# Altium schematic sheet CURRENT_SOURCE.SchDoc
size 420 x 297 mm; SheetNumber: 5; SheetTotal: 6
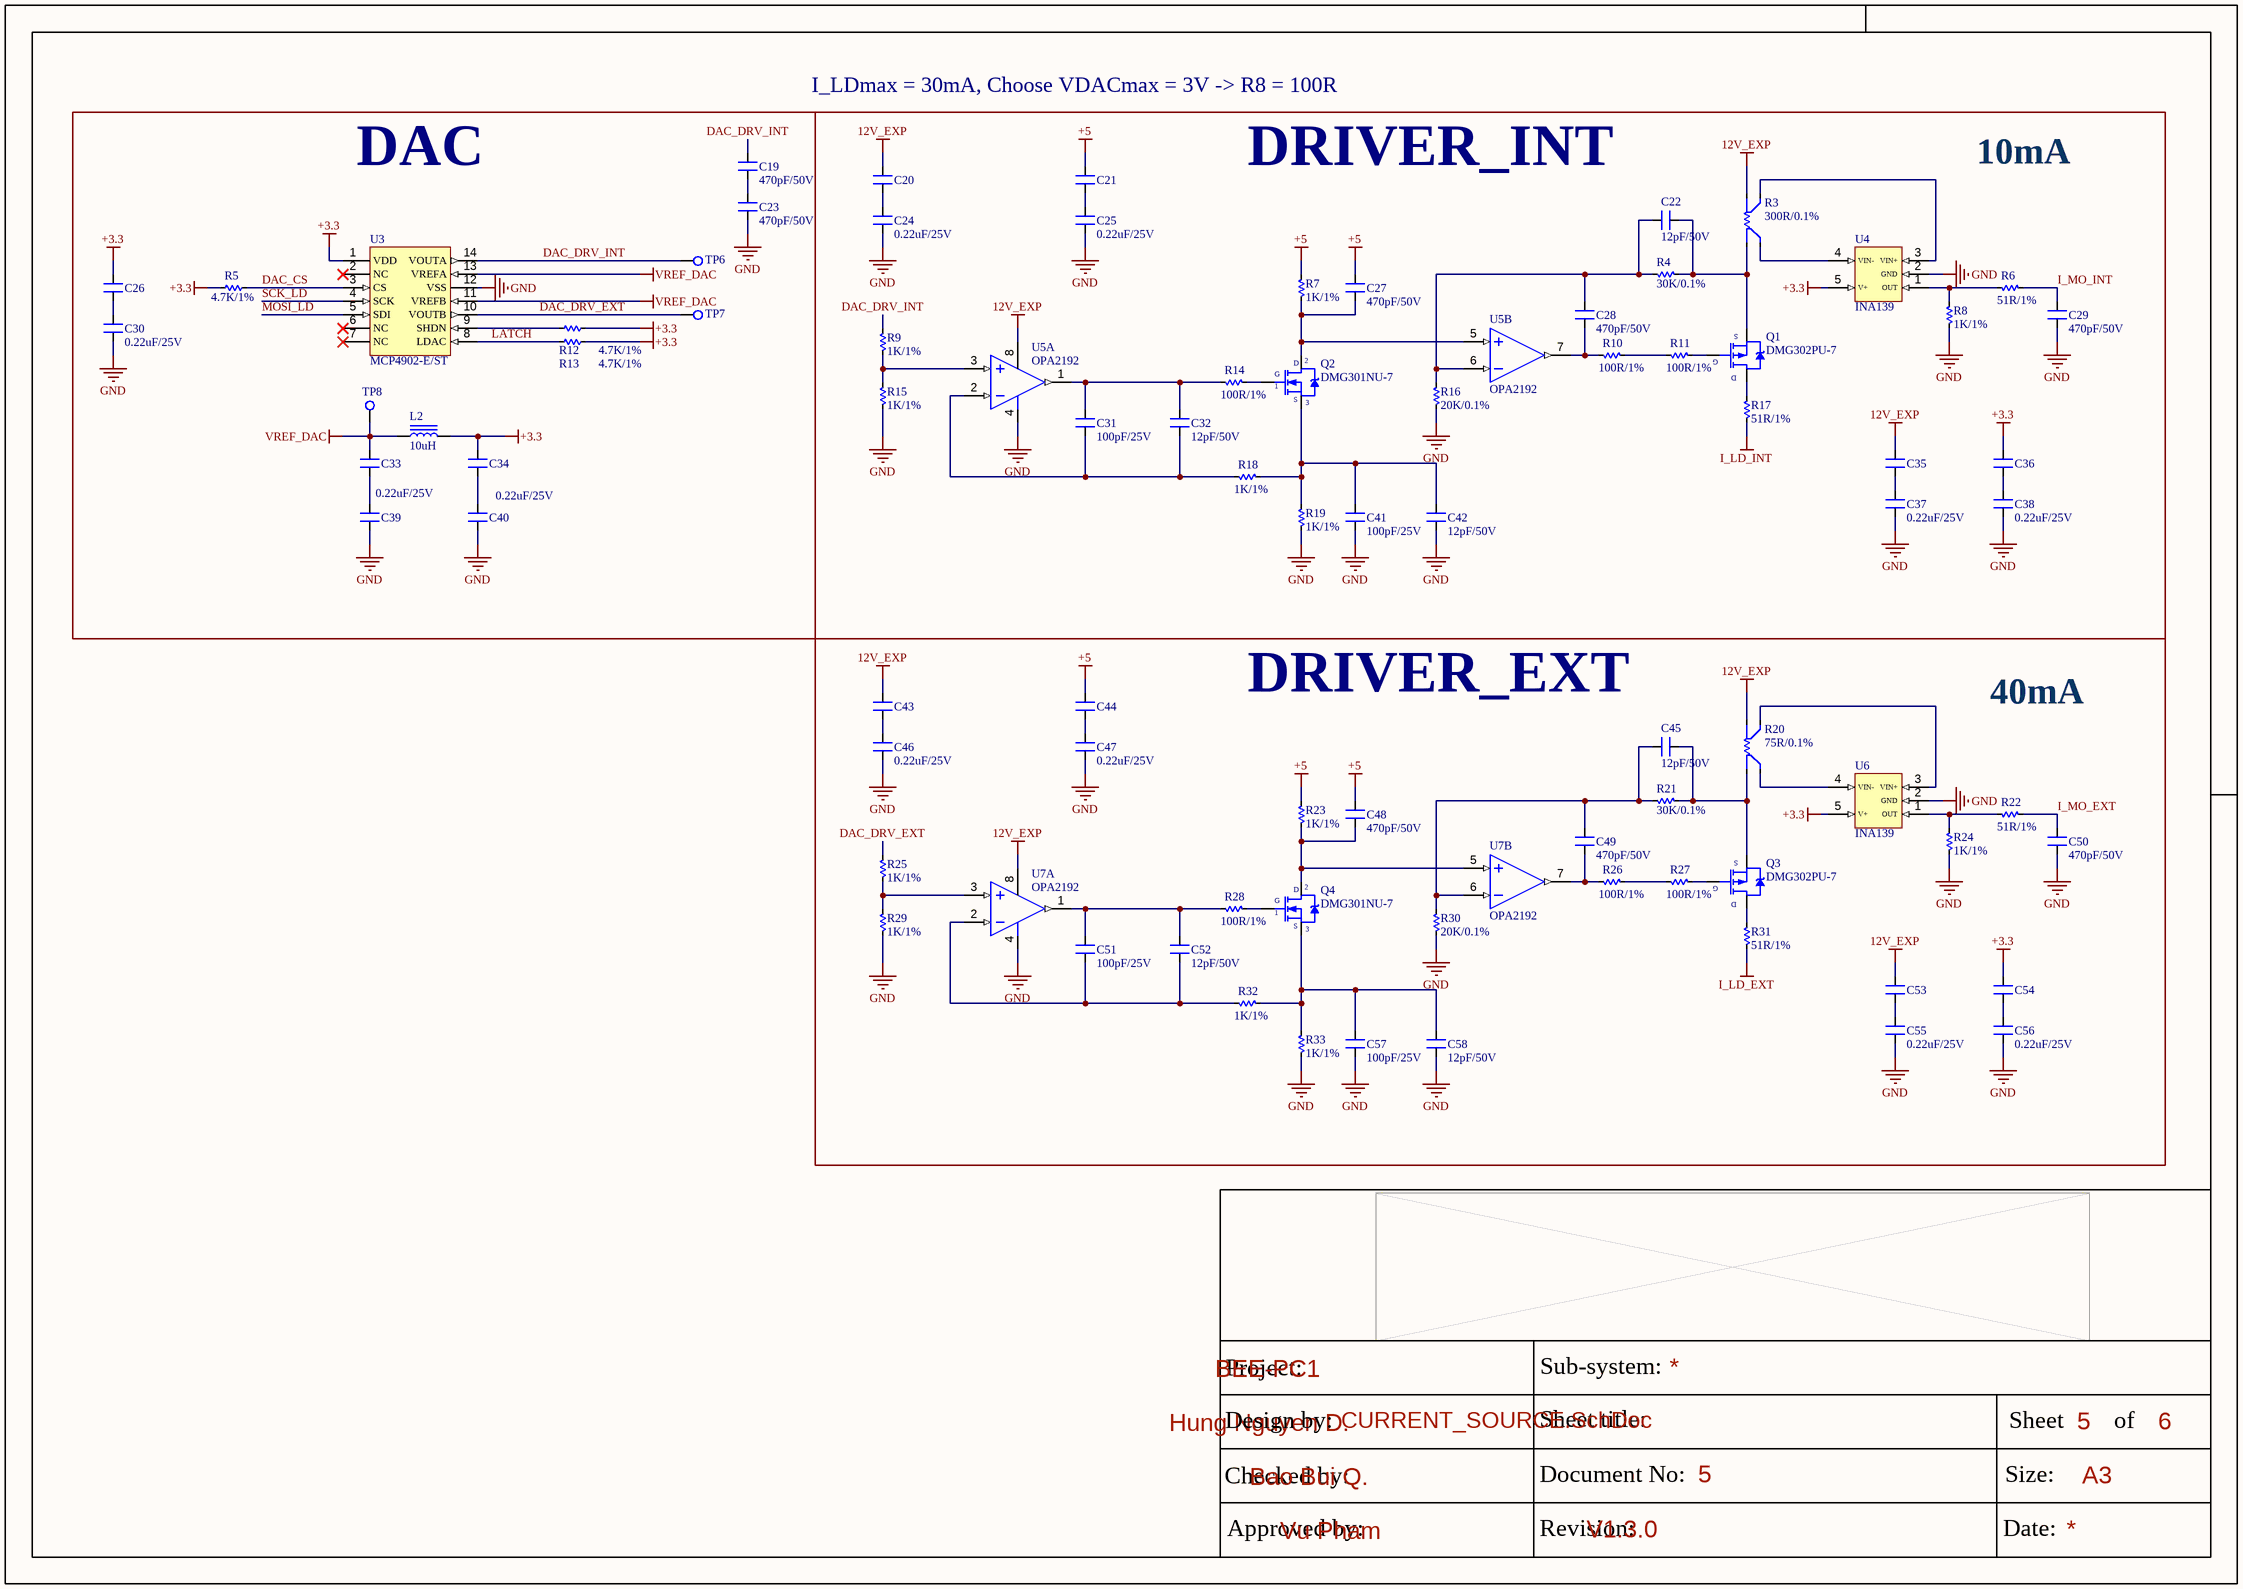
[diagram p0: CURRENT_SOURCE.SchDoc]

## Parts
C19  470pF/50V  [SM-0603]
C20  0.22uF/25V  [SM-0603]  (value not drawn)
C21  0.22uF/25V  [SM-0603]  (value not drawn)
C22  12pF/50V  [SM-0603]
C23  470pF/50V  [SM-0603]
C24  0.22uF/25V  [SM-0603]
C25  0.22uF/25V  [SM-0603]
C26  0.22uF/25V  [SM-0603]  (value not drawn)
C27  470pF/50V  [SM-0603]
C28  470pF/50V  [SM-0603]
C29  470pF/50V  [SM-0603]
C30  0.22uF/25V  [SM-0603]
C31  100pF/25V  [SM-0603]
C32  12pF/50V  [SM-0603]
C33  0.22uF/25V  [SM-0603]  (value not drawn)
C34  0.22uF/25V  [SM-0603]  (value not drawn)
C35  0.22uF/25V  [SM-0603]  (value not drawn)
C36  0.22uF/25V  [SM-0603]  (value not drawn)
C37  0.22uF/25V  [SM-0603]
C38  0.22uF/25V  [SM-0603]
C39  0.22uF/25V  [SM-0603]
C40  0.22uF/25V  [SM-0603]
C41  100pF/25V  [SM-0603]
C42  12pF/50V  [SM-0603]
C43  0.22uF/25V  [SM-0603]  (value not drawn)
C44  0.22uF/25V  [SM-0603]  (value not drawn)
C45  12pF/50V  [SM-0603]
C46  0.22uF/25V  [SM-0603]
C47  0.22uF/25V  [SM-0603]
C48  470pF/50V  [SM-0603]
C49  470pF/50V  [SM-0603]
C50  470pF/50V  [SM-0603]
C51  100pF/25V  [SM-0603]
C52  12pF/50V  [SM-0603]
C53  0.22uF/25V  [SM-0603]  (value not drawn)
C54  0.22uF/25V  [SM-0603]  (value not drawn)
C55  0.22uF/25V  [SM-0603]
C56  0.22uF/25V  [SM-0603]
C57  100pF/25V  [SM-0603]
C58  12pF/50V  [SM-0603]
L2  10uH  [FER 0805/2012]
Q1  DMG302PU-7  [SOT23-3-132]
Q2  DMG301NU-7  [SOT23-3-132]
Q3  DMG302PU-7  [SOT23-3-132]
Q4  DMG301NU-7  [SOT23-3-132]
R3  300R/0.1%  [RES_SMD_0603_SHUNT]
R4  30K/0.1%  [RES-SMD-0603]
R5  4.7K/1%  [RES-SMD-0603]
R6  51R/1%  [RES-SMD-0603]
R7  1K/1%  [RES-SMD-0603]
R8  1K/1%  [RES-SMD-0603]
R9  1K/1%  [RES-SMD-0603]
R10  100R/1%  [RES-SMD-0603]
R11  100R/1%  [RES-SMD-0603]
R12  4.7K/1%  [RES-SMD-0603]
R13  4.7K/1%  [RES-SMD-0603]
R14  100R/1%  [RES-SMD-0603]
R15  1K/1%  [RES-SMD-0603]
R16  20K/0.1%  [RES-SMD-0603]
R17  51R/1%  [RES-SMD-0603]
R18  1K/1%  [RES-SMD-0603]
R19  1K/1%  [RES-SMD-0603]
R20  75R/0.1%  [RES_SMD_0603_SHUNT]
R21  30K/0.1%  [RES-SMD-0603]
R22  51R/1%  [RES-SMD-0603]
R23  1K/1%  [RES-SMD-0603]
R24  1K/1%  [RES-SMD-0603]
R25  1K/1%  [RES-SMD-0603]
R26  100R/1%  [RES-SMD-0603]
R27  100R/1%  [RES-SMD-0603]
R28  100R/1%  [RES-SMD-0603]
R29  1K/1%  [RES-SMD-0603]
R30  20K/0.1%  [RES-SMD-0603]
R31  51R/1%  [RES-SMD-0603]
R32  1K/1%  [RES-SMD-0603]
R33  1K/1%  [RES-SMD-0603]
TP6  Test_Point  [TESTPOINT]  (value not drawn)
TP7  Test_Point  [TESTPOINT]  (value not drawn)
TP8  Test_Point  [TESTPOINT]  (value not drawn)
U3  MCP4902-E/ST  [TSSOP14]
U4  INA139  [SOT23-5]
U5  OPA2192  [SO8]  (parts A,B of 2)
U6  INA139  [SOT23-5]
U7  OPA2192  [SO8]  (parts A,B of 2)

## Blocks framed on the sheet
DAC: C19 C23 C26 C30 C33 C34 C39 C40 L2 R5 R12 R13 TP6-TP8 U3
DRIVER_INT: C20-C22 C24 C25 C27-C29 C31 C32 C35-C38 C41 C42 Q1 Q2 R3 R4 R6-R11 R14-R19 U4 U5
DRIVER_EXT: C43-C58 Q3 Q4 R20-R33 U6 U7

## Nets
12V_EXP: C20.2 C35.2 C43.2 C53.2 R3.1 R20.1 U5.8(+V) U7.8(+V)
+3.3: C26.2 C34.2 C36.2 C54.2 L2.2 R5.2 R12.1 R13.1 U3.1(VDD) U4.5(V+) U6.5(V+)
+5: C21.2 C27.2 C44.2 C48.2 R7.2 R23.2
GND: C23.1 C24.1 C25.1 C29.1 C30.1 C37.1 C38.1 C39.1 C40.1 C41.1 C42.2 C46.1 C47.1 C50.1 C55.1 C56.1 C57.1 C58.2 R8.2 R15.1 R16.1 R19.1 R24.2 R29.1 R30.1 R33.1 U3.12(VSS) U4.2(GND) U5.4(-V) U6.2(GND) U7.4(-V)
I_LD_EXT: R31.1
I_LD_INT: R17.1
VREF_DAC: C33.2 L2.1 TP8.1 U3.11(VREFB) U3.13(VREFA)
DAC_CS: R5.1 U3.3(CS)
DAC_DRV_EXT: R25.2 TP7.1 U3.10(VOUTB)
DAC_DRV_INT: C19.2 R9.2 TP6.1 U3.14(VOUTA)
I_MO_EXT: C50.2 R22.2
I_MO_INT: C29.2 R6.2
LATCH: R13.2 U3.8(LDAC)
MOSI_LD: U3.5(SDI)
SCK_LD: U3.4(SCK)
NetC19_1: C19.1 C23.2
NetC20_1: C20.1 C24.2
NetC21_1: C21.1 C25.2
NetC22_1: C22.1 Q1.3(S) R3.2 R4.1
NetC22_2: C22.2 C28.2 R4.2 R16.2 U5.6(IN-)
NetC26_1: C26.1 C30.2
NetC27_1: C27.1 Q2.2(D) R7.1 U5.5(IN+)
NetC28_1: C28.1 R10.1 U5.7(OUT)
NetC31_1: C31.1 C32.1 R18.1 U5.2(IN-)
NetC31_2: C31.2 C32.2 R14.1 U5.1(OUT)
NetC33_1: C33.1 C39.2
NetC34_1: C34.1 C40.2
NetC35_1: C35.1 C37.2
NetC36_1: C36.1 C38.2
NetC41_2: C41.2 C42.1 Q2.3(S) R18.2 R19.2
NetC43_1: C43.1 C46.2
NetC44_1: C44.1 C47.2
NetC45_1: C45.1 Q3.3(S) R20.2 R21.1
NetC45_2: C45.2 C49.2 R21.2 R30.2 U7.6(IN-)
NetC48_1: C48.1 Q4.2(D) R23.1 U7.5(IN+)
NetC49_1: C49.1 R26.1 U7.7(OUT)
NetC51_1: C51.1 C52.1 R32.1 U7.2(IN-)
NetC51_2: C51.2 C52.2 R28.1 U7.1(OUT)
NetC53_1: C53.1 C55.2
NetC54_1: C54.1 C56.2
NetC57_2: C57.2 C58.1 Q4.3(S) R32.2 R33.2
NetQ1_1: Q1.1(G) R11.2
NetQ1_2: Q1.2(D) R17.2
NetQ2_1: Q2.1(G) R14.2
NetQ3_1: Q3.1(G) R27.2
NetQ3_2: Q3.2(D) R31.2
NetQ4_1: Q4.1(G) R28.2
NetR3_3: R3.3 U4.3(VIN+)
NetR3_4: R3.4 U4.4(VIN-)
NetR6_1: R6.1 R8.1 U4.1(OUT)
NetR9_1: R9.1 R15.2 U5.3(IN+)
NetR10_2: R10.2 R11.1
NetR12_2: R12.2 U3.9(SHDN)
NetR20_3: R20.3 U6.3(VIN+)
NetR20_4: R20.4 U6.4(VIN-)
NetR22_1: R22.1 R24.1 U6.1(OUT)
NetR25_1: R25.1 R29.2 U7.3(IN+)
NetR26_2: R26.2 R27.1

Not connected (* = marked no-connect by the designer): U3 2(NC)* 6(NC)* 7(NC)*

## Notes on the sheet
- I_LDmax = 30mA, Choose VDACmax = 3V -> R8 = 100R
- 10mA
- 40mA
- Project:
- BEE-PC1
- Sub-system:
- Design by:
- Hung Nguyen D.
- Bao Bui Q.
- Sheet title:
- Sheet
- A3
- of
- Checked by:
- Approved by:
- Vu Pham
- Revision:
- Document No:
- V1.3.0
- Size:
- Date:

## Library data of the parts
C19 C23 C27-C29 C48-C50 = CM: CL10B471KB8NNNC; Value: 103
C20 C21 C24-C26 C30 C33-C40 C43 C44 C46 C47 C53-C56 = CM: CL10B224KA8NNNC; Value: 103
C22 C32 C42 C45 C52 C58 = CM: CL10C120JB81PNC; Value: 103
C31 C41 C51 C57 = CM: C0603C101M3HACTU; Value: 103
L2 = Inductor: MLZ1608N100LT000; Value: 1.5uH
Q1 Q3 = P_MOSFET
Q2 Q4 = N_MOSFET
R3 = RES_SMD_SHUNT: RT0603BRC07300RL
R4 R21 = Res-SMD: ERA-3AEB303V; Manufacturer: Generic Components; Class: Passive; Published: 08/06/2000; Publisher: Altium Hobart Technology Centre
R5 R12 R13 = Res-SMD: ERJ-3EKF4701V; Manufacturer: Generic Components; Class: Passive; Published: 08/06/2000; Publisher: Altium Hobart Technology Centre
R6 R17 R22 R31 = Res-SMD: ERJ-3EKF51R0V; Manufacturer: Generic Components; Class: Passive; Published: 08/06/2000; Publisher: Altium Hobart Technology Centre
R7-R9 R15 R18 R19 R23-R25 R29 R32 R33 = Res-SMD: ERJ-3EKF1001V; Manufacturer: Generic Components; Class: Passive; Published: 08/06/2000; Publisher: Altium Hobart Technology Centre
R10 R11 R14 R26-R28 = Res-SMD: ERJ-PA3D1000V; Manufacturer: Generic Components; Class: Passive; Published: 08/06/2000; Publisher: Altium Hobart Technology Centre
R16 R30 = Res-SMD: ERA-3AEB203V; Manufacturer: Generic Components; Class: Passive; Published: 08/06/2000; Publisher: Altium Hobart Technology Centre
R20 = RES_SMD_SHUNT: TNPW060375R0BEEA
U3 = MCP4902
U4 U6 = INA139: INA139NA/250
U5 U7 = LM358: OPA2192IDR; Value: LM358